# EasyEDA schematic SCH_SmartOEEBoard_2023-07-03.json

## Sheets
1 Sheet_1: TITLE: ESP32 Base Board; REV: 1.0; Date: 2023-07-01; Sheet: 1/2; Drawn By: naumanshakir; Company: 3STechLabs
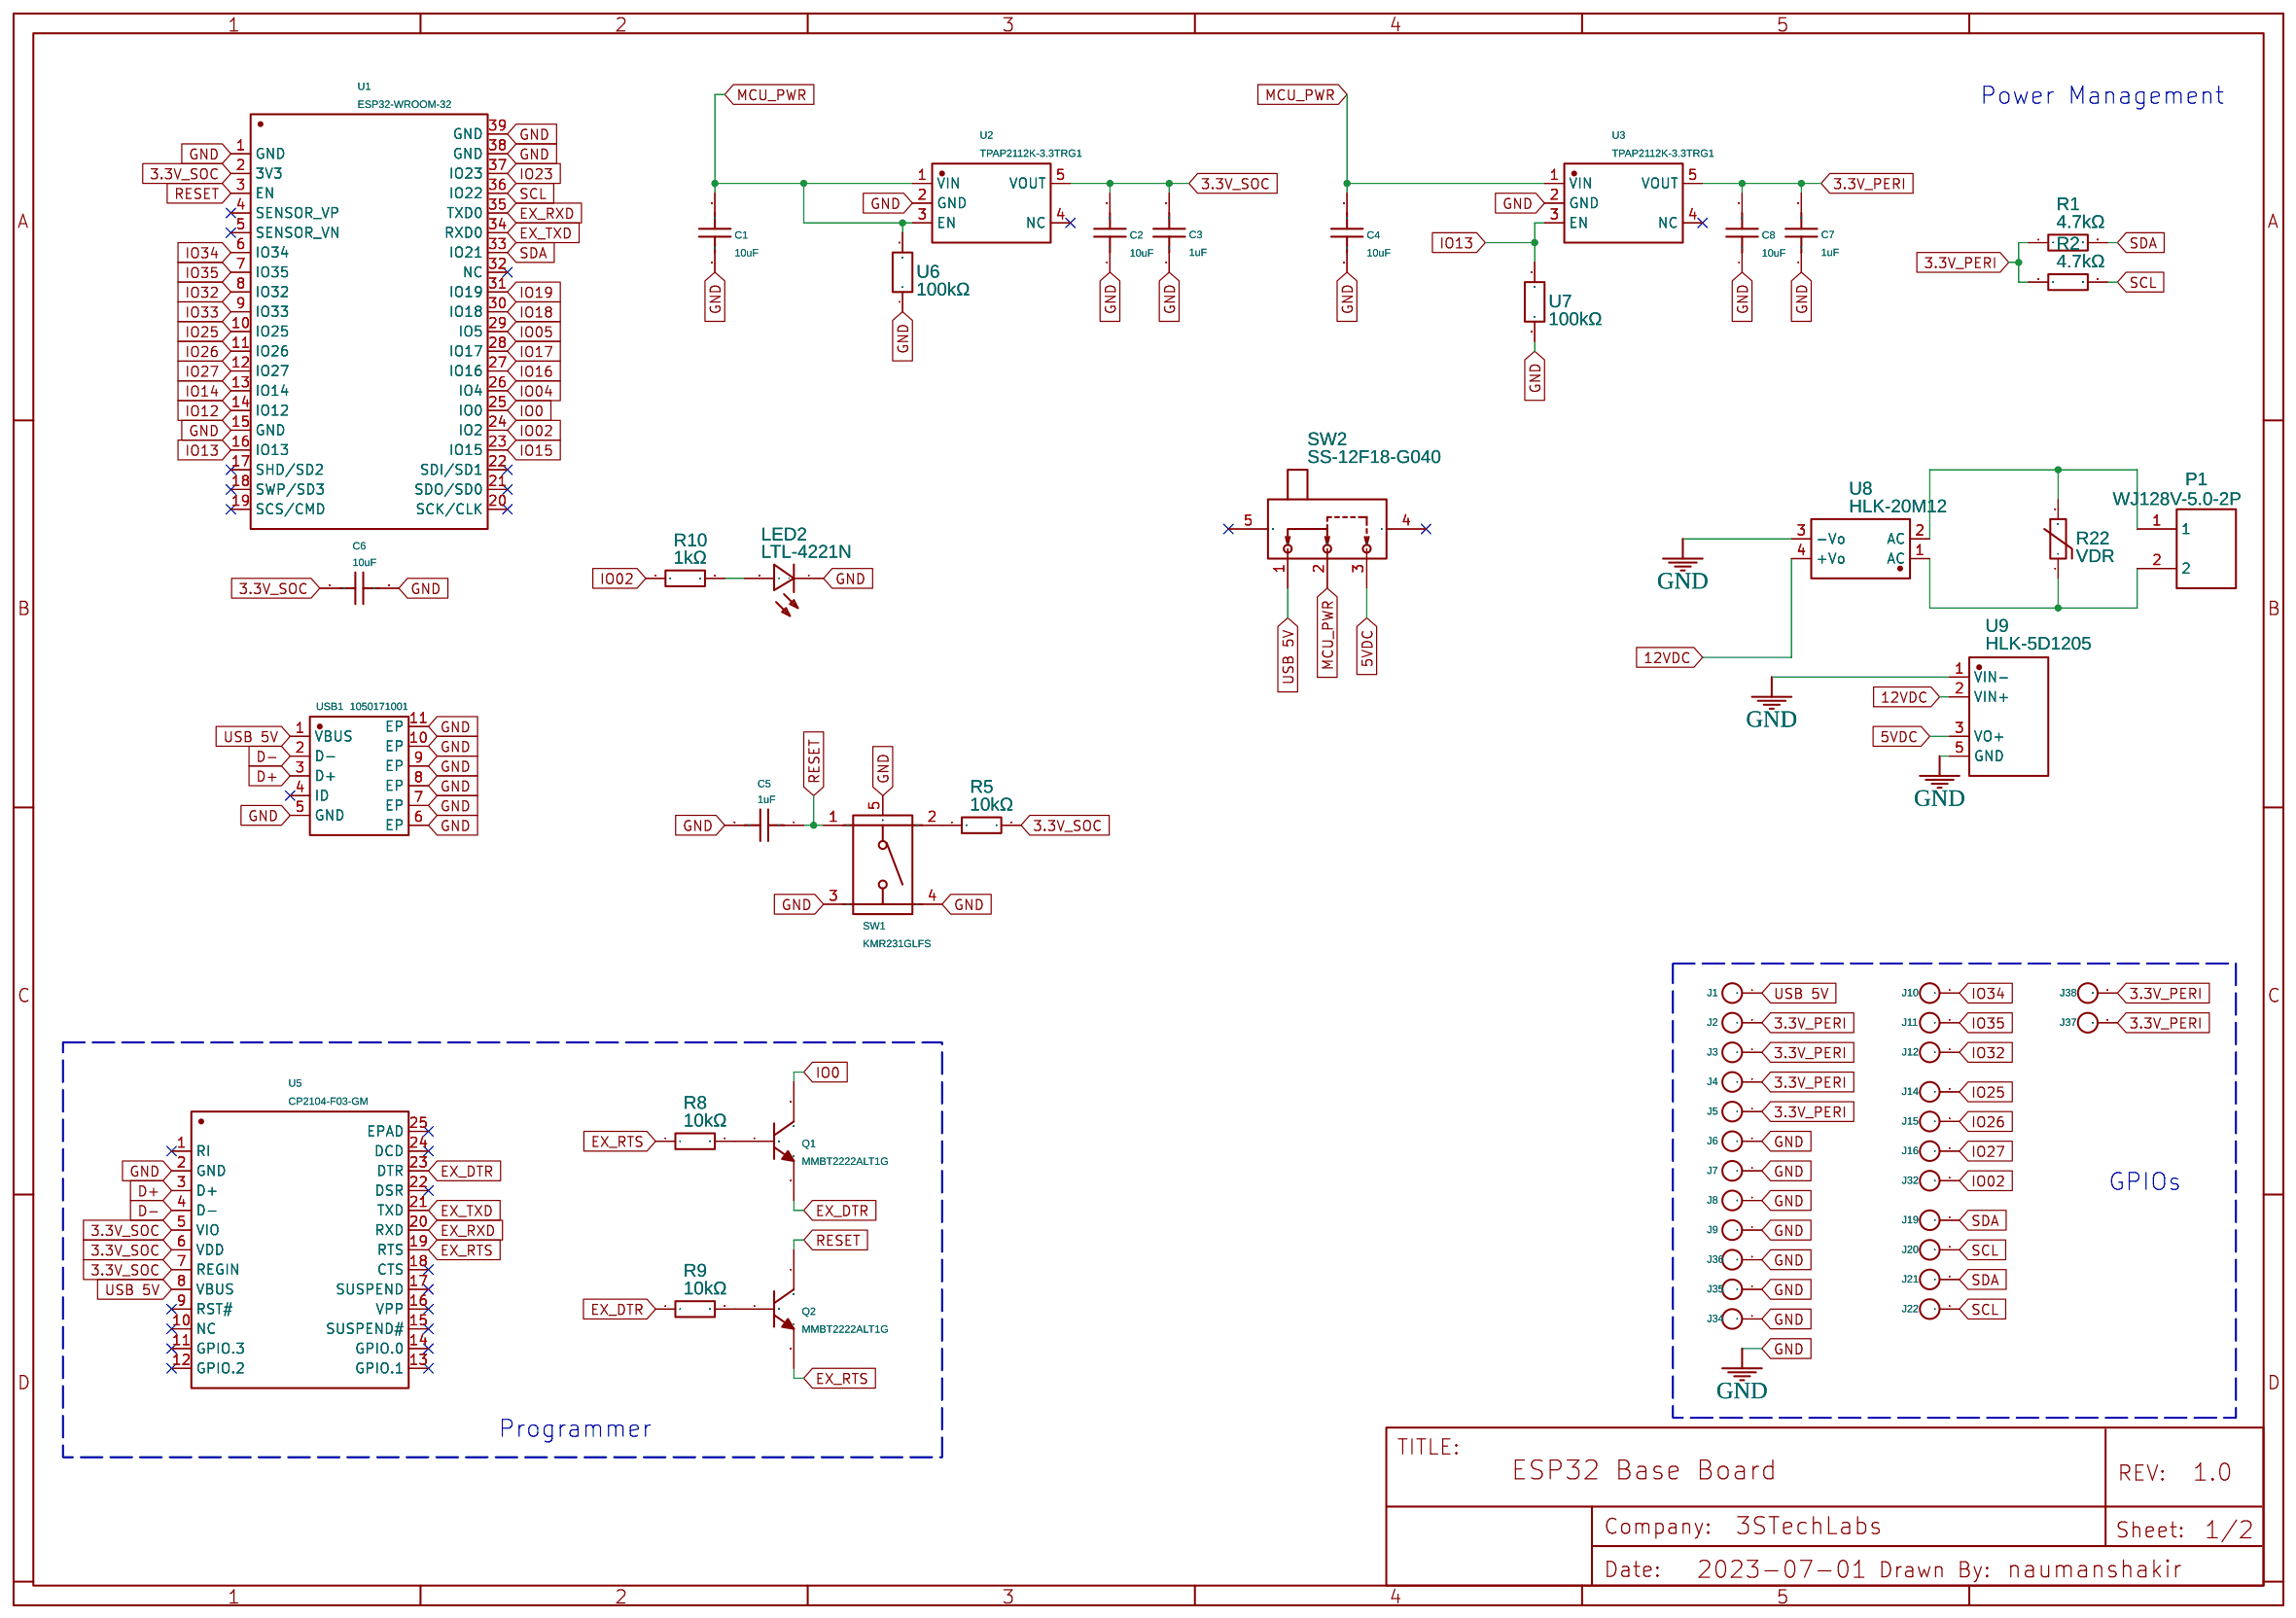
[diagram p0: Sheet_1]
2 Sheet_2: TITLE: OEE Board Connectors/Sensors; Sheet: 2/2
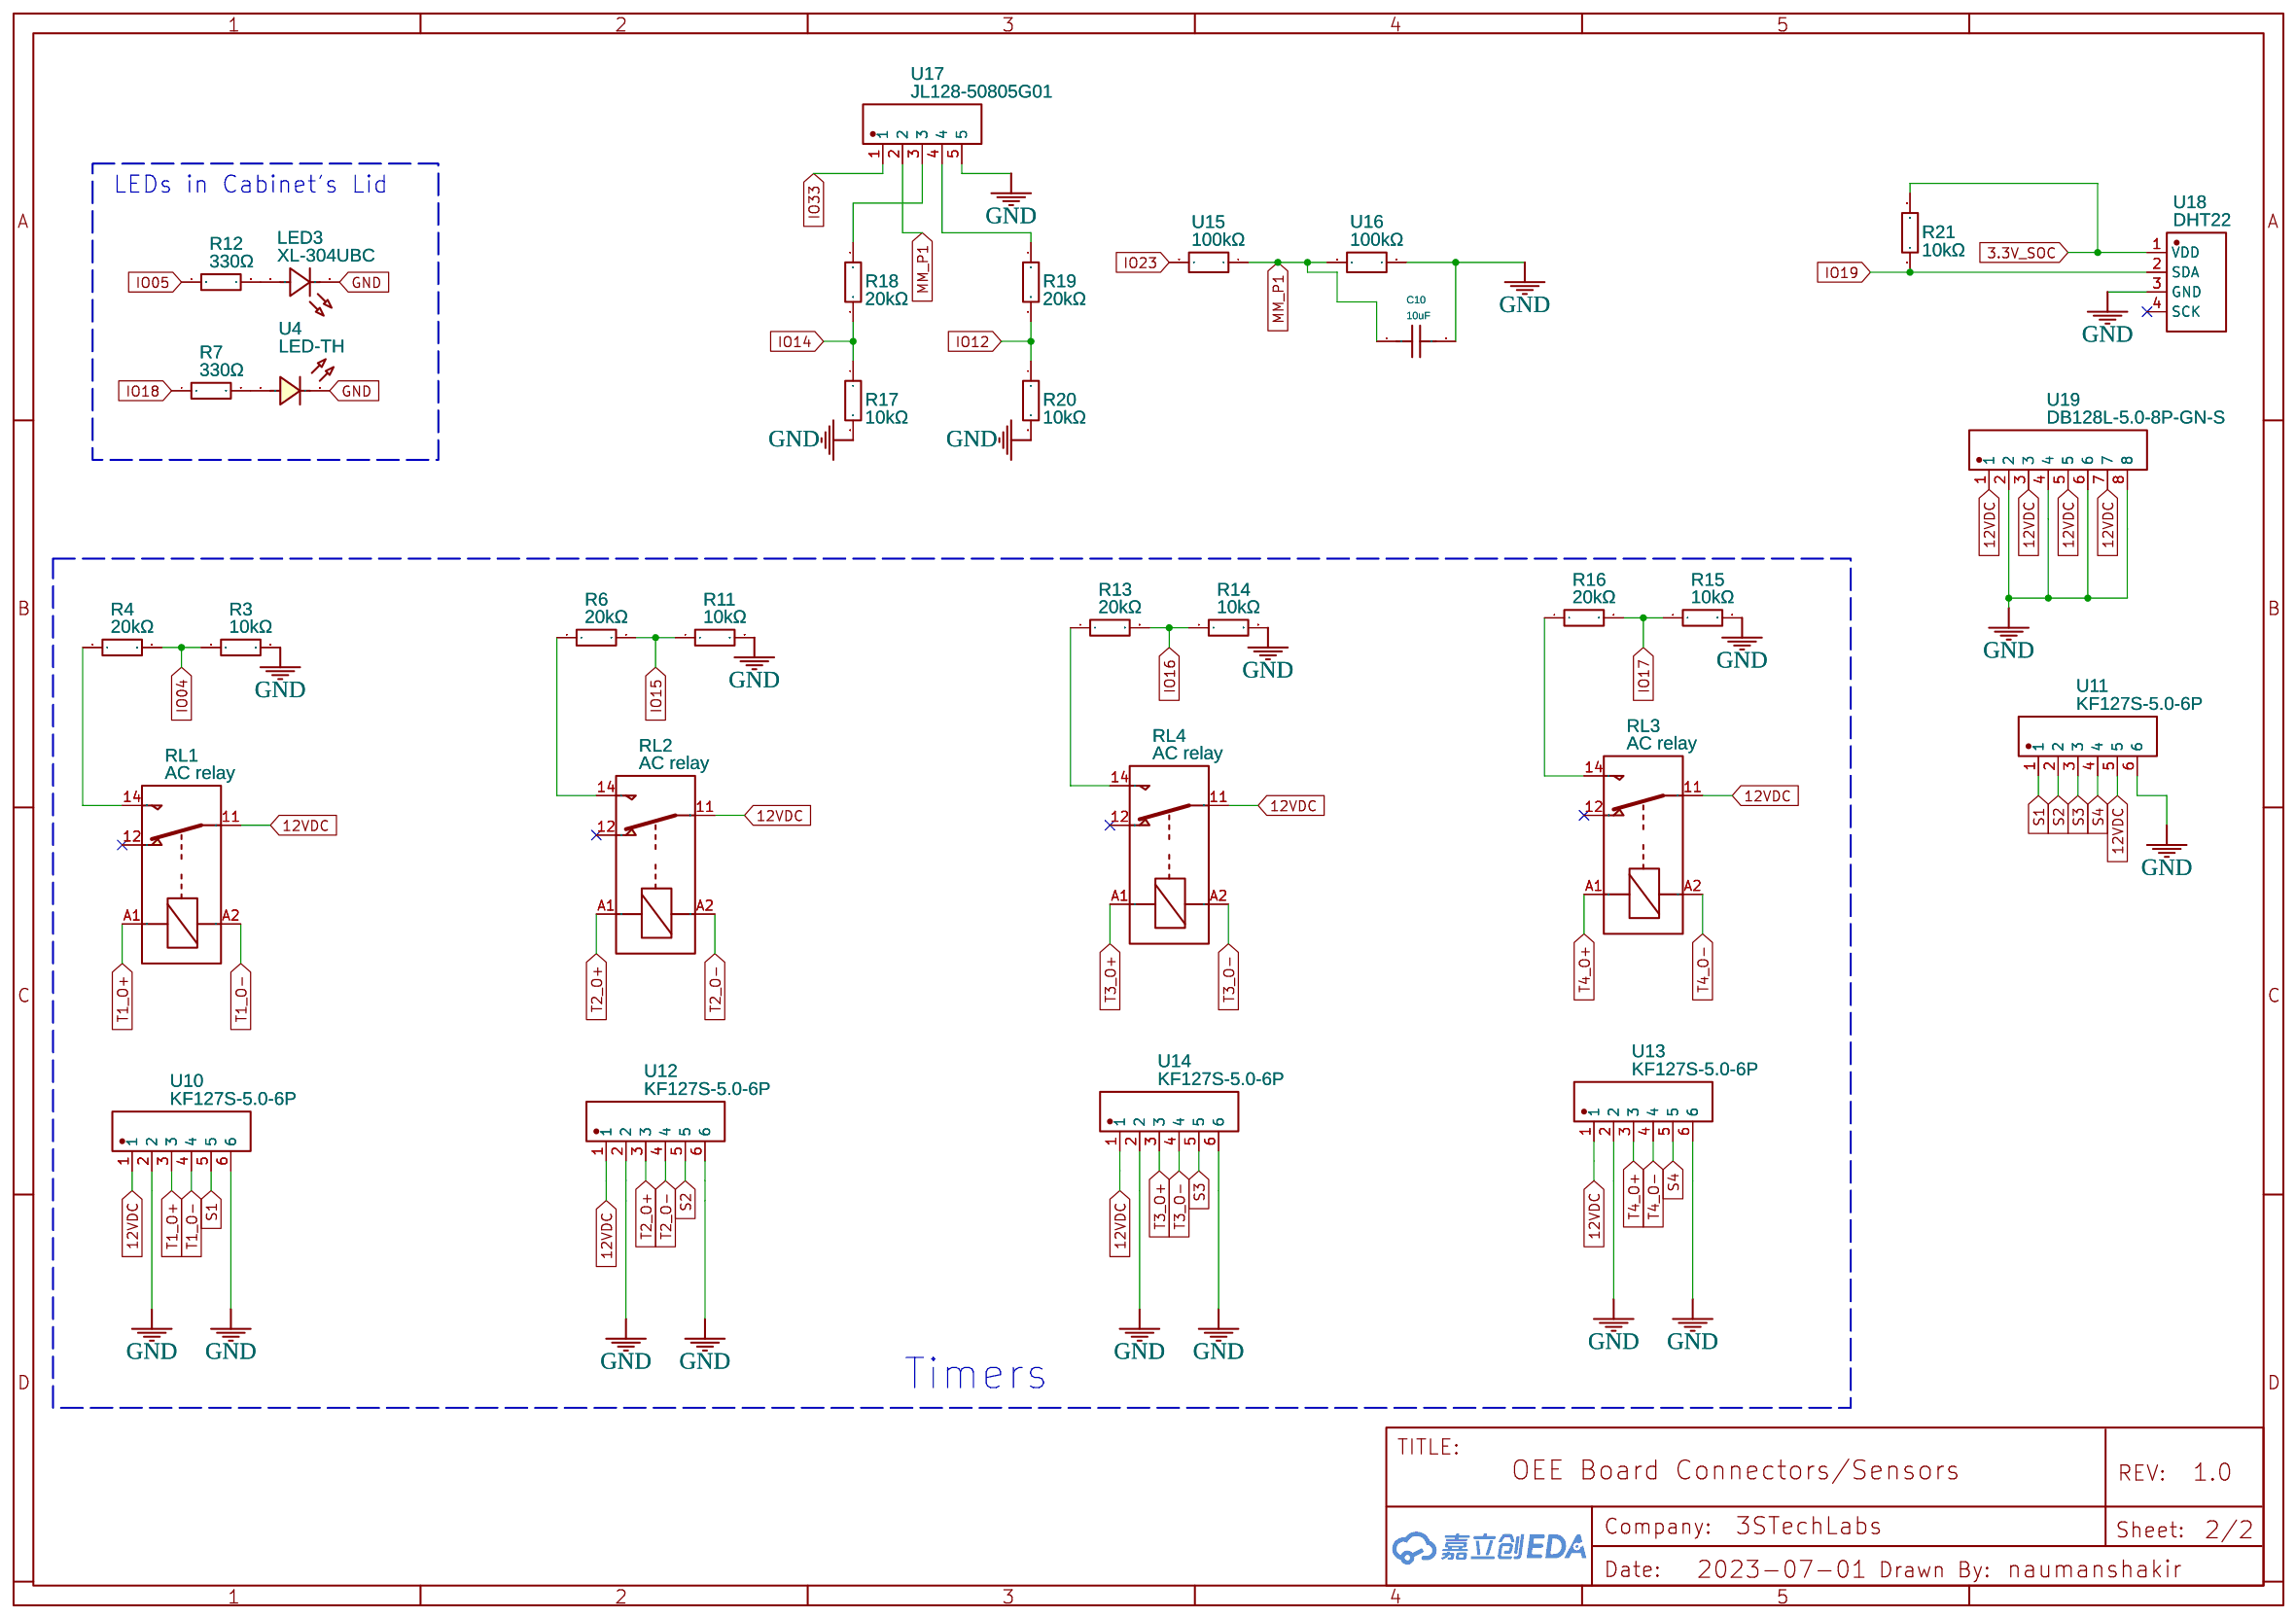
[diagram p1: Sheet_2]

## Parts
sheet Sheet_1
C1  10uF  [C0603]
C2  10uF  [C0603]
C3  1uF  [C0603]
C4  10uF  [C0603]
C5  1uF  [C0603]
C6  10uF  [C0603]
C7  1uF  [C0603]
C8  10uF  [C0603]
J1  THT Pad  [THT PAD]
J2  THT Pad  [THT PAD]
J3  THT Pad  [THT PAD]
J4  THT Pad  [THT PAD]
J5  THT Pad  [THT PAD]
J6  THT Pad  [THT PAD]
J7  THT Pad  [THT PAD]
J8  THT Pad  [THT PAD]
J9  THT Pad  [THT PAD]
J10  THT Pad  [THT PAD]
J11  THT Pad  [THT PAD]
J12  THT Pad  [THT PAD]
J14  THT Pad  [THT PAD]
J15  THT Pad  [THT PAD]
J16  THT Pad  [THT PAD]
J19  THT Pad  [THT PAD]
J20  THT Pad  [THT PAD]
J21  THT Pad  [THT PAD]
J22  THT Pad  [THT PAD]
J32  THT Pad  [THT PAD]
J34  THT Pad  [THT PAD]
J35  THT Pad  [THT PAD]
J36  THT Pad  [THT PAD]
J37  THT Pad  [THT PAD]
J38  THT Pad  [THT PAD]
LED2  LTL-4221N  [LED-TH_BD3.0-P2.54-RD-RED]
P1  WJ128V-5.0-2P  [CONN-TH_2P-P5.00_WJ128V-5.0-2P]
Q1  MMBT2222ALT1G  [SOT-23-3_L2.9-W1.3-P1.90-LS2.4-BR]
Q2  MMBT2222ALT1G  [SOT-23-3_L2.9-W1.3-P1.90-LS2.4-BR]
R1  4.7kΩ  [RES-TH_BD2.3-L6.5-P10.50-D0.5]
R2  4.7kΩ  [RES-TH_BD2.3-L6.5-P10.50-D0.5]
R5  10kΩ  [RES-TH_BD2.3-L6.5-P10.50-D0.5]
R8  10kΩ  [RES-TH_BD2.3-L6.5-P10.50-D0.5]
R9  10kΩ  [RES-TH_BD2.3-L6.5-P10.50-D0.5]
R10  1kΩ  [RES-TH_BD2.3-L6.5-P10.50-D0.5]
R22  VDR  [RES-TH_L9.6-W5.6-P5.00-D0.7-S3.00]
SW1  KMR231GLFS  [KEY-SMD_KMR2XXGXXX]
SW2  SS-12F18-G040  [SW-TH_G-SWITCH_SS-12F18-G040]
U1  ESP32-WROOM-32  [WIFIM-SMD_ESP32-WROOM-32-N4]
U2  TPAP2112K-3.3TRG1  [SOT-23-5_L2.9-W1.6-P0.95-LS2.8-BR]
U3  TPAP2112K-3.3TRG1  [SOT-23-5_L2.9-W1.6-P0.95-LS2.8-BR]
U5  CP2104-F03-GM  [QFN-24_L4.0-W4.0-P0.50-BL-EP2.7]
U6  100kΩ  [RES-TH_BD2.5-L6.5-P10.50-D0.6]
U7  100kΩ  [RES-TH_BD2.5-L6.5-P10.50-D0.6]
U8  HLK-20M12  [PWRM-TH_HLK-20MXX]
U9  HLK-5D1205  [PWRM-TH_HLK-5DXXXX]
USB1  1050171001  [MICRO-USB-SMD_1050171001]
sheet Sheet_2
C10  10uF  [C0603]
LED3  XL-304UBC  [LED-TH_BD3.8-P2.54-FD_BLUE]
R3  10kΩ  [RES-TH_BD2.3-L6.5-P10.50-D0.5]
R4  20kΩ  [RES-TH_BD2.3-L6.5-P10.50-D0.5]
R6  20kΩ  [RES-TH_BD2.3-L6.5-P10.50-D0.5]
R7  330Ω  [RES-TH_BD2.2-L6.5-P10.50-D0.6]
R11  10kΩ  [RES-TH_BD2.3-L6.5-P10.50-D0.5]
R12  330Ω  [RES-TH_BD2.2-L6.5-P10.50-D0.6]
R13  20kΩ  [RES-TH_BD2.3-L6.5-P10.50-D0.5]
R14  10kΩ  [RES-TH_BD2.3-L6.5-P10.50-D0.5]
R15  10kΩ  [RES-TH_BD2.3-L6.5-P10.50-D0.5]
R16  20kΩ  [RES-TH_BD2.3-L6.5-P10.50-D0.5]
R17  10kΩ  [RES-TH_BD2.3-L6.5-P10.50-D0.5]
R18  20kΩ  [RES-TH_BD2.3-L6.5-P10.50-D0.5]
R19  20kΩ  [RES-TH_BD2.3-L6.5-P10.50-D0.5]
R20  10kΩ  [RES-TH_BD2.3-L6.5-P10.50-D0.5]
R21  10kΩ  [RES-TH_BD2.3-L6.5-P10.50-D0.5]
RL1  AC relay  [FINDER RELAY 40.51]
RL2  AC relay  [FINDER RELAY 40.51]
RL3  AC relay  [FINDER RELAY 40.51]
RL4  AC relay  [FINDER RELAY 40.51]
U4  LED-TH  [LED-TH_BD3.8-P2.28_GREEN]
U10  KF127S-5.0-6P  [CONN-TH_6P-P5.00_KEFA_KF127S-5.0-6P]
U11  KF127S-5.0-6P  [CONN-TH_6P-P5.00_KEFA_KF127S-5.0-6P]
U12  KF127S-5.0-6P  [CONN-TH_6P-P5.00_KEFA_KF127S-5.0-6P]
U13  KF127S-5.0-6P  [CONN-TH_6P-P5.00_KEFA_KF127S-5.0-6P]
U14  KF127S-5.0-6P  [CONN-TH_6P-P5.00_KEFA_KF127S-5.0-6P]
U15  100kΩ  [RES-TH_BD2.5-L6.5-P10.50-D0.6]
U16  100kΩ  [RES-TH_BD2.5-L6.5-P10.50-D0.6]
U17  JL128-50805G01  [CONN-TH_JL128-50005G01]
U18  DHT22  [SENSOR-TH_HAIGU_DHT22]
U19  DB128L-5.0-8P-GN-S  [CONN-TH_8P-P5.00_DB128L-5.0-8P-GN-S]

## Library data of the parts
C1 C4 C10 = 0603X106K100CT: Supplier: LCSC; Supplier Part: C2840513; Manufacturer: Walsin(华新科); JLCPCB Part Class: Extended Part; Contributor: LCSC
C2 C6 C8 = C0603X5R106M160NT: Supplier: LCSC; Supplier Part: C466781; Manufacturer: SANYEAR(叁叶源); Contributor: LCSC; JLCPCB Part Class: Extended Part
C3 C5 C7 = CC0603KRX7R6BB105: Supplier: LCSC; Supplier Part: C113807; Manufacturer: YAGEO(国巨); Contributor: LCSC; JLCPCB Part Class: Extended Part
J1-J12 J14-J16 J19-J22 J32 J34-J38 = THT Pad: Contributor: menguy
LED2 = LTL-4221N: Supplier: LCSC; Supplier Part: C125081; Manufacturer: LITEON(光宝); Contributor: LCSC; JLCPCB Part Class: Extended Part
P1 = WJ128V-5.0-2P: Supplier: LCSC; Manufacturer: KANGNEX(康奈克斯电气); Supplier Part: C8269; JLCPCB Part Class: Extended Part
Q1 Q2 = MMBT2222ALT1G: Supplier: LCSC; Manufacturer: onsemi(安森美); Supplier Part: C82460; JLCPCB Part Class: Extended Part
R1 R2 = CF1/4W-4.7KΩ±5% T52: Supplier: LCSC; Supplier Part: C120071; Manufacturer: CCO(千志电子); Manufacturer Part: CF1/4W-4.7KΩ±5% T; Resistance (Ohms): 4.7K; Contributor: LCSC; JLCPCB Part Class: Extended Part
R3 R5 R8 R9 R11 R14 R15 R17 R20 R21 = MF1/4W-10KΩ±1% T52: Supplier: LCSC; Supplier Part: C119347; Manufacturer: CCO(千志电子); Manufacturer Part: MF1/4W-10KΩ±1% T; Resistance (Ohms): 10K; Contributor: LCSC; JLCPCB Part Class: Extended Part
R10 = CF1/4W-1KΩ±5% T52: Supplier: LCSC; Supplier Part: C120055; Manufacturer: CCO(千志电子); Manufacturer Part: CF1/4W-1KΩ±5% T; Resistance (Ohms): 1K; Contributor: LCSC; JLCPCB Part Class: Extended Part
R22 = VDR-07D241K: Supplier: LCSC; Supplier Part: C283926; Manufacturer: VDR(嵩隆); Contributor: LCSC; JLCPCB Part Class: Extended Part
SW1 = KMR231GLFS: Supplier: LCSC; Supplier Part: C99271; Manufacturer: C&K; Contributor: LCSC; JLCPCB Part Class: Extended Part
SW2 = SS-12F18-G040: Supplier: LCSC; Supplier Part: C2848918; Manufacturer: G-Switch(品赞); Contributor: LCSC; JLCPCB Part Class: Extended Part
U1 = ESP32-WROOM-32: Supplier: LCSC; Supplier Part: C82899; Manufacturer: ESPRESSIF(乐鑫); Manufacturer Part: ESP32-WROOM-32-N4; Contributor: LCSC; JLCPCB Part Class: Extended Part
U2 U3 = TPAP2112K-3.3TRG1: Supplier: LCSC; Supplier Part: C3021085; Manufacturer: TECH PUBLIC(台舟); link: https://atta.szlcsc.com/upload/public/pdf/source/20220524/8CF0233C3A5BEC2862946B9116FD2D75.pdf; Contributor: lcsc; JLCPCB Part Class: Extended Part
U5 = CP2104-F03-GM: Supplier: LCSC; Manufacturer: SILICON LABS(芯科); Manufacturer Part: CP2104-F03-GMR; Supplier Part: C47742; JLCPCB Part Class: Extended Part
U6 U7 U15 U16 = RI40-1/4W-100KΩ±1%T: Supplier: LCSC; Supplier Part: C714626; Manufacturer: 华星机电; link: https://atta.szlcsc.com/upload/public/pdf/source/20200731/C714531_AD63ADE1939354DF9C89AA88364E3DE5.pdf; Contributor: lcsc; JLCPCB Part Class: Extended Part
U8 = HLK-20M12: Supplier: LCSC; Supplier Part: C465408; Manufacturer: HI-LINK(海凌科); Contributor: LCSC; JLCPCB Part Class: Extended Part
U9 = HLK-5D1205: Supplier: LCSC; Supplier Part: C474033; Manufacturer: HI-LINK(海凌科); Contributor: LCSC; JLCPCB Part Class: Extended Part
USB1 = 1050171001: Supplier: LCSC; Supplier Part: C505111; Manufacturer: MOLEX; Contributor: LCSC; JLCPCB Part Class: Extended Part
LED3 = XL-304UBC: Supplier: LCSC; Supplier Part: C2895465; Manufacturer: XINGLIGHT(成兴光); Contributor: lcsc; JLCPCB Part Class: Extended Part
R4 R6 R13 R16 R18 R19 = CF1/4W-20KΩ±5% T52: Supplier: LCSC; Supplier Part: C120086; Manufacturer: CCO(千志电子); Manufacturer Part: CF1/4W-20KΩ±5% T; Resistance (Ohms): 20K; Contributor: LCSC; JLCPCB Part Class: Extended Part
R7 R12 = MF1/4CCT52A3300F: Supplier: LCSC; Supplier Part: C315657; Manufacturer: KOA; Resistance (Ohms): 330; Contributor: LCSC; JLCPCB Part Class: Extended Part
RL1-RL4 = AC relay: Contributor: yousif hassan; sourceId: HDnhbHngy
U4 = LED-TH: Supplier: LCSC; Supplier Part: C9900001201; Manufacturer: null; Manufacturer Part: 绿发翠绿φ3直插长脚28mm; JLCPCB Part Class: Extended Part; link: https://item.taobao.com/item.htm?id=609620392891; Contributor: LCSC
U10-U14 = KF127S-5.0-6P: Supplier: LCSC; Supplier Part: C2974921; Manufacturer: KEFA(科发); link: https://atta.szlcsc.com/upload/public/pdf/source/20220302/06316A83FFF55AFBAA1370400CFF5228.pdf; Contributor: LCSC
U17 = JL128-50805G01: Supplier: LCSC; Supplier Part: C2961928; Manufacturer: JILN(锦凌); link: https://atta.szlcsc.com/upload/public/pdf/source/20190827/C415423_C0251F1284E6F17C40775A81096DDEE1.pdf; Contributor: LCSC
U18 = DHT22: Supplier: LCSC; Supplier Part: C2880291; Manufacturer: HAIGU(广州海谷); Contributor: LCSC; JLCPCB Part Class: Extended Part
U19 = DB128L-5.0-8P-GN-S: Supplier: LCSC; Supplier Part: C430596; Manufacturer: DIBO(地博电气); Contributor: LCSC; JLCPCB Part Class: Extended Part

## Nets
3.3V_PERI: C7.2 C8.2 J2.1 J3.1 J4.1 J5.1 J37.1 J38.1 R1.1 R2.1 U3.5(VOUT)
3.3V_SOC: C2.2 C3.2 C6.2 R5.2 R21.2 U1.2(3V3) U2.5(VOUT) U5.5(VIO) U5.6(VDD) U5.7(REGIN) U18.1(VDD)
5VDC: SW2.3 U9.3(VO+)
12VDC: RL1.11 RL2.11 RL3.11 RL4.11 U8.4(+Vo) U9.2(VIN+) U10.1 U11.5 U12.1 U13.1 U14.1 U19.1 U19.3 U19.5 U19.7
GND: C1.2 C2.1 C3.1 C4.2 C5.2 C6.1 C7.1 C8.1 C10.2 J6.1 J7.1 J8.1 J9.1 J34.1 J35.1 J36.1 LED2.1(-) LED3.2(K) R3.2 R11.2 R14.2 R15.2 R17.2 R20.2 SW1.3 SW1.4 SW1.5 U1.1(GND) U1.15(GND) U1.38(GND) U1.39(GND) U2.2(GND) U3.2(GND) U4.2(K) U5.2(GND) U6.1 U7.1 U8.3(-Vo) U9.1(VIN-) U9.5(GND) U10.2 U10.6 U11.6 U12.2 U12.6 U13.2 U13.6 U14.2 U14.6 U16.1 U17.5 U18.3(GND) U19.2 U19.4 U19.6 U19.8 USB1.5(GND) USB1.6(EP) USB1.7(EP) USB1.8(EP) USB1.9(EP) USB1.10(EP) USB1.11(EP)
D+: U5.3(D+) USB1.3(D+)
D-: U5.4(D-) USB1.2(D-)
EX_DTR: Q1.2(E) R9.1 U5.23(DTR)
EX_RTS: Q2.2(E) R8.1 U5.19(RTS)
EX_RXD: U1.35(TXD0) U5.20(RXD)
EX_TXD: U1.34(RXD0) U5.21(TXD)
IO0: Q1.3(C) U1.25(IO0)
IO02: J32.1 R10.1 U1.24(IO2)
IO04: R3.1 R4.2 U1.26(IO4)
IO05: R12.1 U1.29(IO5)
IO12: R19.2 R20.1 U1.14(IO12)
IO13: U1.16(IO13) U3.3(EN) U7.2
IO14: R17.1 R18.2 U1.13(IO14)
IO15: R6.2 R11.1 U1.23(IO15)
IO16: R13.2 R14.1 U1.27(IO16)
IO17: R15.1 R16.2 U1.28(IO17)
IO18: R7.1 U1.30(IO18)
IO19: R21.1 U1.31(IO19) U18.2(SDA)
IO23: U1.37(IO23) U15.2
IO25: J14.1 U1.10(IO25)
IO26: J15.1 U1.11(IO26)
IO27: J16.1 U1.12(IO27)
IO32: J12.1 U1.8(IO32)
IO33: U1.9(IO33) U17.1
IO34: J10.1 U1.6(IO34)
IO35: J11.1 U1.7(IO35)
MCU_PWR: C1.1 C4.1 SW2.2 U2.1(VIN) U2.3(EN) U3.1(VIN) U6.2
MM_P1: C10.1 U15.1 U16.2 U17.2
RESET: C5.1 Q2.3(C) SW1.1 U1.3(EN)
S1: U10.5 U11.1
S2: U11.2 U12.5
S3: U11.3 U14.5
S4: U11.4 U13.5
SCL: J20.1 J22.1 R2.2 U1.36(IO22)
SDA: J19.1 J21.1 R1.2 U1.33(IO21)
T1_O+: RL1.A1 U10.3
T1_O-: RL1.A2 U10.4
T2_O+: RL2.A1 U12.3
T2_O-: RL2.A2 U12.4
T3_O+: RL4.A1 U14.3
T3_O-: RL4.A2 U14.4
T4_O+: RL3.A1 U13.3
T4_O-: RL3.A2 U13.4
USB 5V: J1.1 SW2.1 U5.8(VBUS) USB1.1(VBUS)
Net-(LED2-2): LED2.2(+) R10.2
Net-(LED3-1): LED3.1(A) R12.2
Net-(P1-1): P1.1 R22.2 U8.2(AC)
Net-(P1-2): P1.2 R22.1 U8.1(AC)
Net-(Q1-1): Q1.1(B) R8.2
Net-(Q2-1): Q2.1(B) R9.2
Net-(R4-1): R4.1 RL1.14
Net-(R5-1): R5.1 SW1.2
Net-(R6-1): R6.1 RL2.14
Net-(R7-2): R7.2 U4.1(A)
Net-(R13-1): R13.1 RL4.14
Net-(R16-1): R16.1 RL3.14
Net-(R18-1): R18.1 U17.3
Net-(R19-1): R19.1 U17.4

Not connected (* = marked no-connect by the designer): RL1 12*; RL2 12*; RL3 12*; RL4 12*; SW2 4* 5*; U1 4(SENSOR_VP)* 5(SENSOR_VN)* 17(SHD/SD2)* 18(SWP/SD3)* 19(SCS/CMD)* 20(SCK/CLK)* 21(SDO/SD0)* 22(SDI/SD1)* 32(NC)*; U2 4(NC)*; U3 4(NC)*; U5 1(RI)* 9(RST#)* 10(NC)* 11(GPIO.3)* 12(GPIO.2)* 13(GPIO.1)* 14(GPIO.0)* 15(SUSPEND#)* 16(VPP)* 17(SUSPEND)* 18(CTS)* 22(DSR)* 24(DCD)* 25(EPAD)*; U18 4(SCK)*; USB1 4(ID)*

## Notes on the sheets
sheet 1
- Power Management
- GPIOs
- Programmer
sheet 2
- LEDs in Cabinet's Lid
- Timers
